# EAGLE design LED - Chaser Forward Reverse (EAGLE 9.6.2)
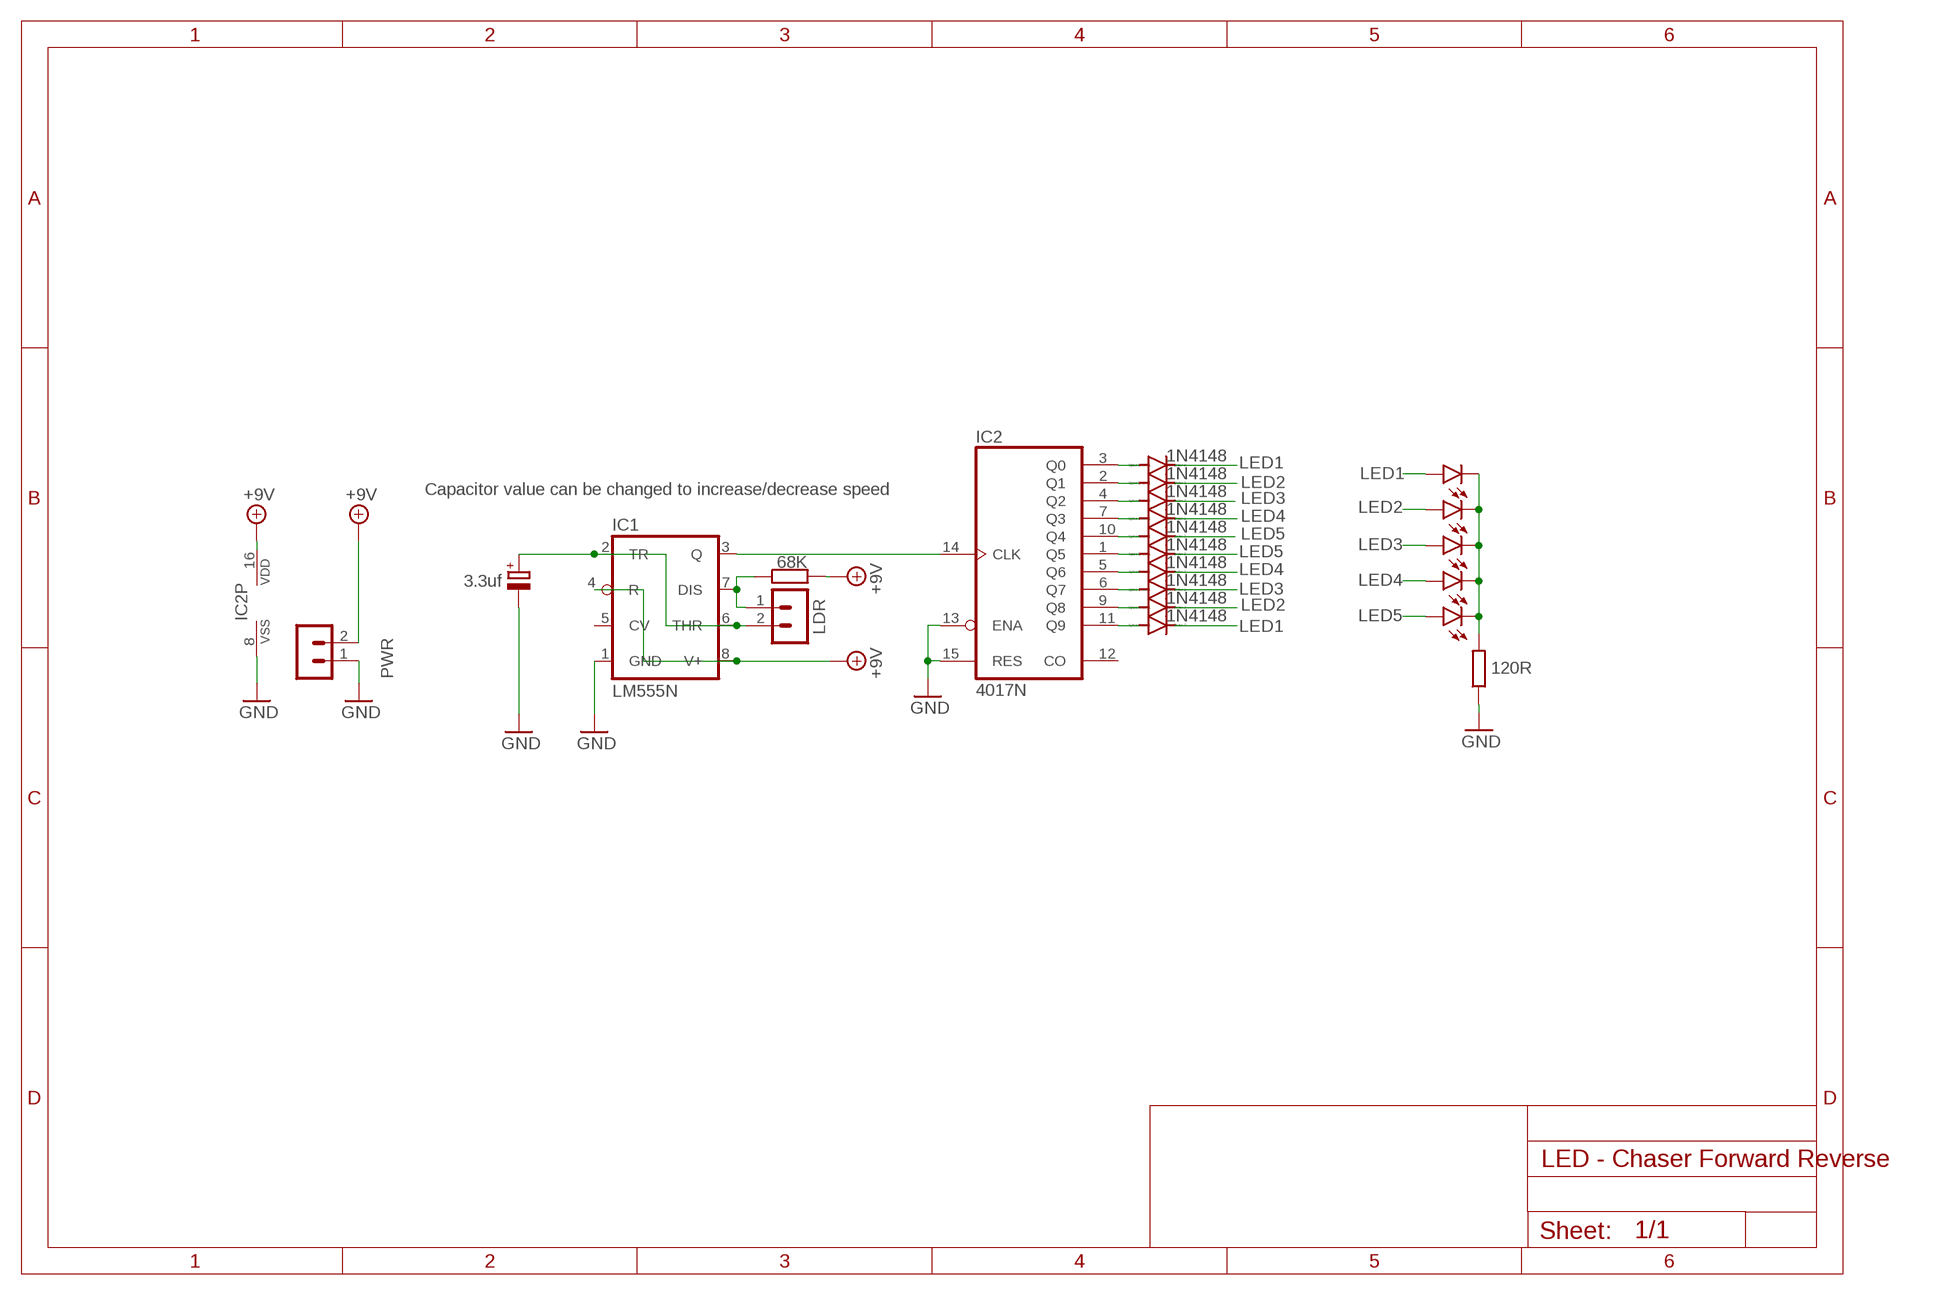
[diagram p0: schematic, sheet 1]

## Parts
C1  3.3uf  CPOL-EUE2.5-5  [E2,5-5]
D1  1N4148  1N4148DO35-7  [DO35-7]
D2  1N4148  1N4148DO35-7  [DO35-7]
D3  1N4148  1N4148DO35-7  [DO35-7]
D4  1N4148  1N4148DO35-7  [DO35-7]
D5  1N4148  1N4148DO35-7  [DO35-7]
D6  1N4148  1N4148DO35-7  [DO35-7]
D7  1N4148  1N4148DO35-7  [DO35-7]
D8  1N4148  1N4148DO35-7  [DO35-7]
D9  1N4148  1N4148DO35-7  [DO35-7]
D10  1N4148  1N4148DO35-7  [DO35-7]
IC1  LM555N  [DIL08]
IC2  4017N  [DIL16]
LDR  B2B-PH-K-S  [B2B-PH-K-S]
LED1  LED3MM  [LED3MM]
LED2  LED3MM  [LED3MM]
LED3  LED3MM  [LED3MM]
LED4  LED3MM  [LED3MM]
LED5  LED3MM  [LED3MM]
PWR  B2B-PH-K-S  [B2B-PH-K-S]
R1  68K  R-EU_0207/10  [0207/10]
R2  120R  R-EU_0207/10  [0207/10]

## Nets
+9V: IC1.4(R) IC1.8(V+) IC2.16(VDD) PWR.2 R1.2
GND: C1.- IC1.1(GND) IC2.8(VSS) IC2.13(ENA) IC2.15(RES) PWR.1 R2.1
LED1: D1.C D10.C LED1.A
LED2: D2.C D9.C LED2.A
LED3: D3.C D8.C LED3.A
LED4: D4.C D7.C LED4.A
LED5: D5.C D6.C LED5.A
N$1: IC1.7(DIS) LDR.1 R1.1
N$2: C1.+ IC1.2(TR) IC1.6(THR) LDR.2
N$3: IC1.3(Q) IC2.14(CLK)
N$4: LED1.K(C) LED2.K(C) LED3.K(C) LED4.K(C) LED5.K(C) R2.2
N$5: D1.A IC2.3(Q0)
N$6: D2.A IC2.2(Q1)
N$7: D3.A IC2.4(Q2)
N$8: D4.A IC2.7(Q3)
N$9: D5.A IC2.10(Q4)
N$10: D6.A IC2.1(Q5)
N$11: D7.A IC2.5(Q6)
N$12: D8.A IC2.6(Q7)
N$13: D9.A IC2.9(Q8)
N$14: D10.A IC2.11(Q9)
Unconnected: IC1.5(CV) IC2.12(CO)

## Notes on the sheet
- Capacitor value can be changed to increase/decrease speed

## Library data of the parts
C1 = rcl:CPOL-EU: POLARIZED CAPACITOR, European symbol; SPICEPREFIX: C
D1-D10 = diode:1N4148: DIODE high speed (Philips)
IC1 = linear4:*555: TIMER
IC2 = 40xx:4017: COUNTER/DIVIDER
LDR PWR = con-JST PH:B2B-PH: JST PH series header 2.00mm pitch disconnectable crimp style connectors, vertical (side entry type), 2 pins
LED1-LED5 = led:LED: LED OSRAM: - CHIPLED LG R971, LG N971, LY N971, LG Q971, LY Q971, LO R971, LY R971 LH N974, LH R974 LS Q976, LO Q976, LY Q976 LO Q996 - Hyper CHIPLED LW Q18S LB Q993, LB Q99A, LB R99A - SideLED LS A670, LO A670, LY A670, LG A670, LP A670 LB A673, LV A673, LT A673, LW A673 LH A674 LY A675 LS A676, LA A676, LO A676, LY A676, LW A676 LS A679, LY A679, LG A679 - Hyper Micro SIDELED® LS Y876, LA Y876, LO Y876, LY Y876 LT Y87S - SmartLED LW L88C, LW L88S LB L89C, LB L89S, LG L890 LS L89K, LO L89K, LY L89K LS L896, LA L896, LO L896, LY L896 - TOPLED LS T670, LO T670, LY T670, LG T670, LP T670 LSG T670, LSP T670, LSY T670, LOP T670, LYG T670 LG T671, LOG T671, LSG T671 LB T673, LV T673, LT T673, LW T673 LH T674 LS T676, LA T676, LO T676, LY T676, LB T676, LH T676, LSB T676, LW T676 LB T67C, LV T67C, LT T67C, LS T67K, LO T67K, LY T67K, LW E67C LS E67B, LA E67B, LO E67B, LY E67B, LB E67C, LV E67C, LT E67C LW T67C LS T679, LY T679, LG T679 LS T770, LO T770, LY T770, LG T770, LP T770 LB T773, LV T773, LT T773, LW T773 LH T774 LS E675, LA E675, LY E675, LS T675 LS T776, LA T776, LO T776, LY T776, LB T776 LHGB T686 LT T68C, LB T68C - Hyper Mini TOPLED® LB M676 - Mini TOPLED Santana® LG M470 LS M47K, LO M47K, LY M47K Source: http://www.osram.convergy.de LUXEON: - LUMILED® LXK2-PW12-R00, LXK2-PW12-S00, LXK2-PW14-U00, LXK2-PW14-V00 LXK2-PM12-R00, LXK2-PM12-S00, LXK2-PM14-U00 LXK2-PE12-Q00, LXK2-PE12-R00, LXK2-PE12-S00, LXK2-PE14-T00, LXK2-PE14-U00 LXK2-PB12-K00, LXK2-PB12-L00, LXK2-PB12-M00, LXK2-PB14-N00, LXK2-PB14-P00, LXK2-PB14-Q00 LXK2-PR12-L00, LXK2-PR12-M00, LXK2-PR14-Q00, LXK2-PR14-R00 LXK2-PD12-Q00, LXK2-PD12-R00, LXK2-PD12-S00 LXK2-PH12-R00, LXK2-PH12-S00 LXK2-PL12-P00, LXK2-PL12-Q00, LXK2-PL12-R00 Source: www.luxeon.com KINGBRIGHT: KA-3528ASYC Source: www.kingbright.com
R1 R2 = rcl:R-EU_: RESISTOR, European symbol; SPICEPREFIX: R

## Board
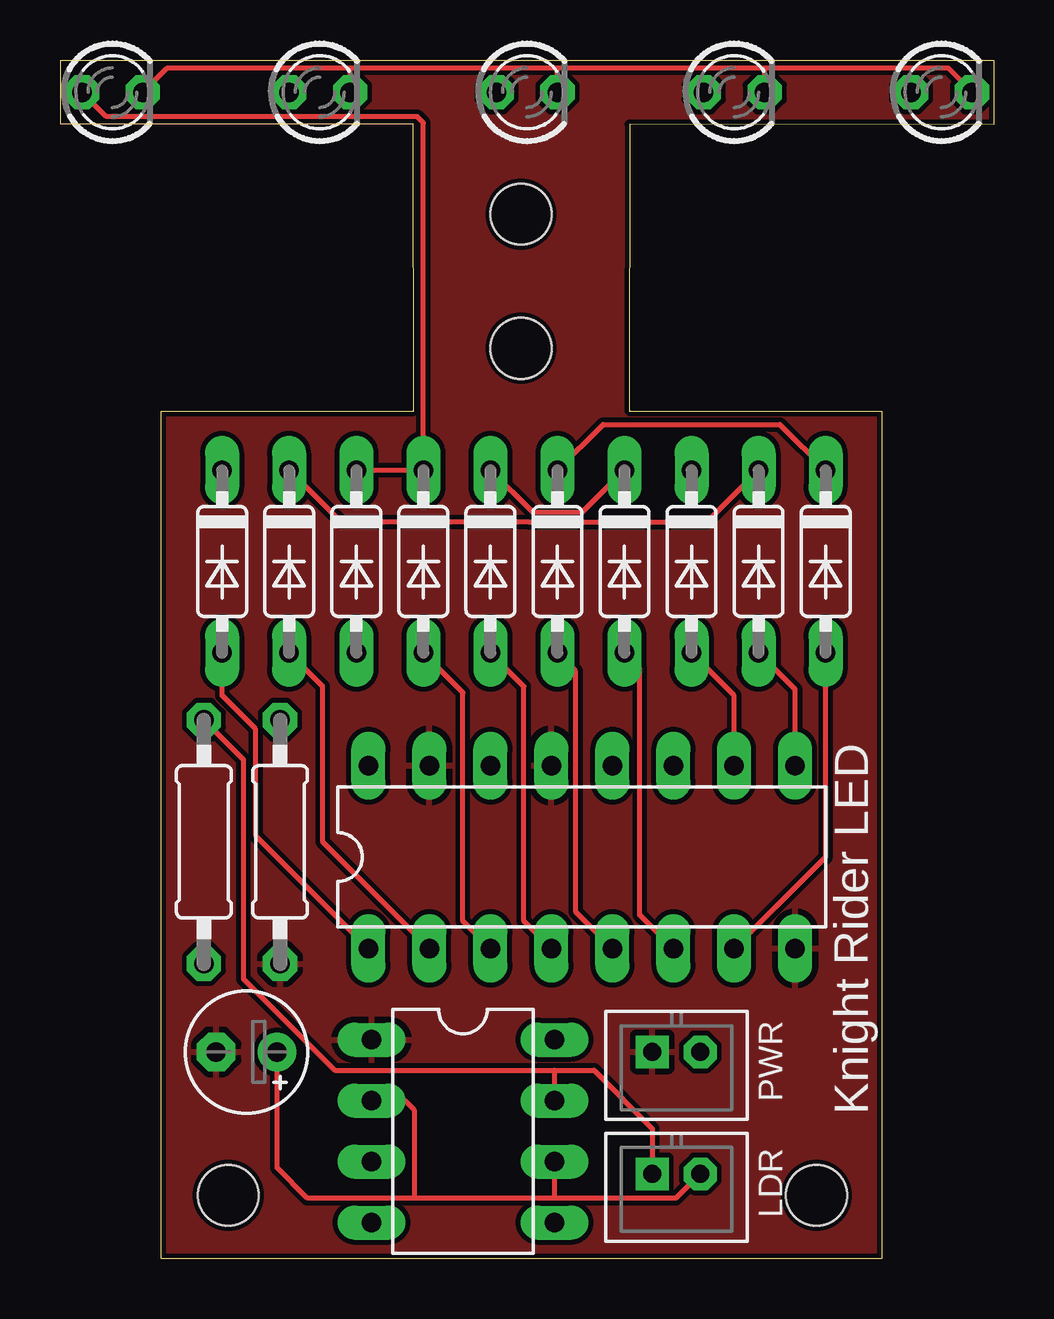
[diagram p1: board, top side]
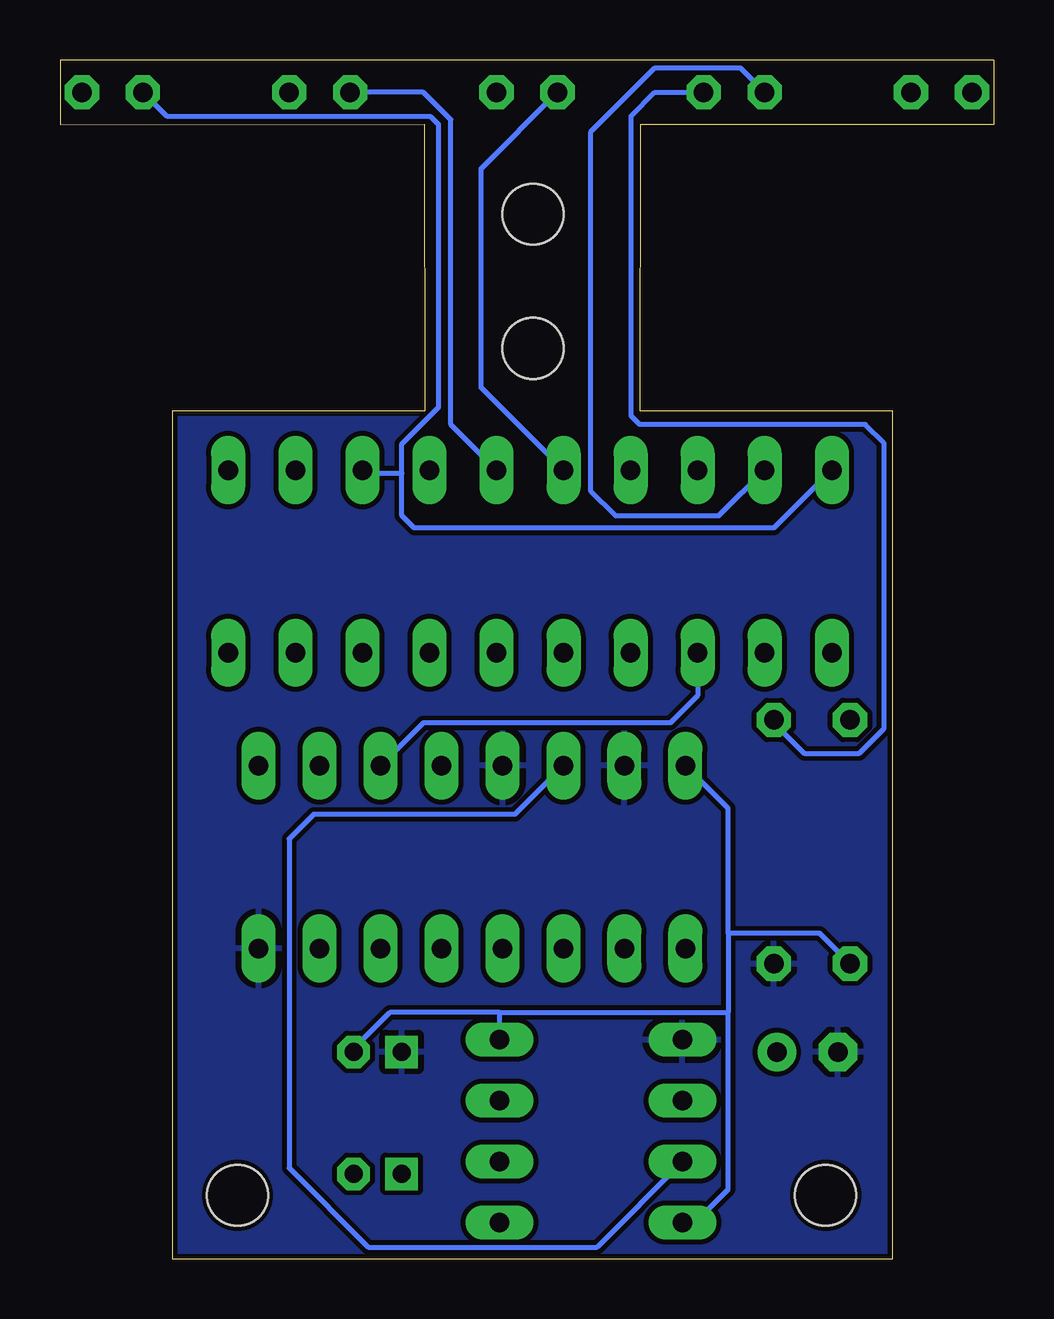
[diagram p2: board, bottom side, seen from below]

Size 38.91 x 49.96 mm. Coordinates in mm from the lower left corner, seen from the top.
Outline: 0,49.96 0,47.29 14.72,47.28 14.73,35.33 4.22,35.33 4.22,0 34.24,0 34.24,35.33 23.72,35.33 23.74,47.28 38.91,47.27 38.91,49.96 0,49.96
Copper layers (1*16): Top 0.035mm / dielectric 1.5mm / Bottom 0.035mm
Design rules "SparkFun": minimum track width 8mil, minimum drill 20mil, track to track 8mil, track to pad 8mil, pad to pad 8mil, via to via 8mil, smd to smd 8mil, copper to edge 8mil, drill to drill 8mil, minimum pad ring 12mil, minimum via ring 10mil, stop-mask expansion 4mil, vias tented up to drill 20mil, thermal gap 10mil
Holes 2.54 mm at 19.2,37.95 31.52,2.64 7.01,2.64 19.2,43.54

### Footprints (pad centres in the part's own frame; a part is rotated, then mirrored left to right if it is on the bottom)
E2,5-5 = drill 0.813 pad 1.6: + -1.27,0 | drill 0.813 pad 1.6 octagon: - 1.27,0
DO35-7 = drill 0.813 long: A 3.81,0; C -3.81,0
DIL08 = drill 0.813 long: 1 -3.81,-3.81; 2 -1.27,-3.81; 3 1.27,-3.81; 4 3.81,-3.81; 5 3.81,3.81; 6 1.27,3.81; 7 -1.27,3.81; 8 -3.81,3.81
DIL16 = drill 0.813 long: 1 -8.89,-3.81; 2 -6.35,-3.81; 3 -3.81,-3.81; 4 -1.27,-3.81; 5 1.27,-3.81; 6 3.81,-3.81; 7 6.35,-3.81; 8 8.89,-3.81; 9 8.89,3.81; 10 6.35,3.81; 11 3.81,3.81; 12 1.27,3.81; 13 -1.27,3.81; 14 -3.81,3.81; 15 -6.35,3.81; 16 -8.89,3.81
B2B-PH-K-S = drill 0.75 pad 1.3 square: 1 1,0 | drill 0.75 pad 1.3 octagon: 2 -1,0
LED3MM = drill 0.813 octagon: A -1.27,0; K 1.27,0
0207/10 = drill 0.813 octagon: 1 -5.08,0; 2 5.08,0

### Placement (x,y rotation side)
C1  7.77,8.61 180 top
D1  15.14,29.06 270 top
D2  9.55,29.06 270 top
D3  17.93,29.06 270 top
D4  31.9,29.06 270 top
D5  26.31,29.06 270 top
D6  6.76,29.06 270 top
D7  20.73,29.06 270 top
D8  23.52,29.06 270 top
D9  29.11,29.06 270 top
D10  12.34,29.06 270 top
IC1  16.79,5.31 270 top
IC2  21.74,16.74 0 top
LDR  25.68,3.53 180 top
LED1  2.18,48.62 0 top
LED2  10.82,48.62 0 top
LED3  19.46,48.62 0 top
LED4  28.09,48.62 0 top
LED5  36.73,48.62 0 top
PWR  25.68,8.61 180 top
R1  5.99,17.37 270 top
R2  9.17,17.37 90 top

### Tracks (layer width: path | path; a pad name or v marks a point on that pad's centre or on a via)
+9V
  Bottom 0.203: IC2.16 11.07,18.77 11.07,13.56 | IC1.4 12.47,1.5 11.07,2.9 11.07,10.26 | 11.07,13.56 11.07,10.26 | IC1.8 20.6,10.26 | 20.6,10.26 25.17,10.26 26.68,8.75 PWR.2 | 20.6,10.26 11.07,10.26 | R1.2 7.26,13.56 11.07,13.56
GND
  pour Top: 0,49.96 38.91,49.96 38.91,47.27 23.72,47.27 23.72,35.33 34.24,35.33 34.24,0 4.22,0 4.22,35.33 14.73,35.33 14.73,47.29 0,47.29
  pour Bottom: 0,49.96 38.91,49.96 38.91,47.27 23.72,47.27 23.72,35.33 34.24,35.33 34.24,0 4.22,0 4.22,35.33 14.73,35.33 14.73,47.29 0,47.29
LED1
  Top 0.203: D10.C D1.C 15.14,47.35 14.88,47.6 1.93,47.6 LED1.A
LED2
  Top 0.203: D9.C 26.92,30.68 19.54,30.68 19.52,30.71 11.71,30.71 D2.C
  Bottom 0.203: LED2.A 10.57,49.63 14.12,49.63 16.79,46.96 16.79,31.98 15.77,30.96 11.46,30.96 D2.C
LED3
  Top 0.203: D8.C 21.74,31.09 19.71,31.09 D3.C
  Bottom 0.203: D3.C 21.36,36.3 21.36,45.44 LED3.A
LED4
  Top 0.203: D7.C 22.63,34.77 30,34.77 D4.C
  Bottom 0.203: D7.C 22.63,34.77 22.63,47.47 23.77,48.62 LED4.A
LED5
  Bottom 0.203: D6.C 9.17,30.45 24.16,30.45 24.66,30.96 24.66,32.74 | LED5.A 34.44,47.6 23.47,47.6 23.14,47.27 23.14,35.48 24.66,33.96 24.66,32.74 | D5.C 26.19,32.74 24.66,32.74
N$1
  Top 0.203: R1.1 7.65,20.8 7.65,11.66 11.46,7.85 20.6,7.85 | 20.6,7.85 IC1.7 | 20.6,7.85 22.25,7.85 24.68,5.42 LDR.1
N$2
  Top 0.203: LDR.2 25.66,2.51 20.6,2.51 | 20.6,2.51 14.76,2.51 | 14.76,2.51 10.31,2.51 9.04,3.78 C1.+ | IC1.6 20.6,2.51 | IC1.2 14.38,6.58 14.76,6.2 14.76,2.51
N$3
  Bottom 0.203: IC2.14 19.96,18.52 28.35,18.52 29.36,17.5 29.36,3.78 26.06,0.48 16.54,0.48 IC1.3
N$4
  Top 0.203: LED1.K 4.47,49.63 12.09,49.63 | 12.09,49.63 20.73,49.63 | 20.73,49.63 29.36,49.63 | 29.36,49.63 37.01,49.63 38,48.64 LED5.K | LED4.K 29.36,49.63 | LED3.K 20.73,49.63 | LED2.K 12.09,49.63
  Bottom 0.203: R2.2 9.17,22.33 7.9,21.06 5.61,21.06 4.6,22.07 4.6,34.01 5.36,34.77 14.76,34.77 15.11,35.13 15.11,47.62 14.12,48.62 LED2.K
N$5
  Top 0.203: IC2.3 16.79,14.07 16.79,23.6 D1.A
N$6
  Top 0.203: IC2.2 10.95,17.37 10.95,23.85 D2.A
N$7
  Top 0.203: IC2.4 19.33,14.07 19.33,23.85 D3.A
N$8
  Top 0.203: IC2.7 31.9,16.74 D4.A
N$9
  Top 0.203: IC2.10 28.09,23.47 D5.A
N$10
  Top 0.203: IC2.1 8.15,17.63 8.15,22.07 6.76,23.47 D6.A
N$11
  Top 0.203: IC2.5 21.49,14.45 21.49,24.49 D7.A
N$12
  Top 0.203: IC2.6 24.16,14.33 24.16,24.61 D8.A
N$13
  Top 0.203: IC2.9 30.63,23.72 D9.A
N$14
  Bottom 0.203: D10.A 12.34,23.47 13.49,22.33 23.77,22.33 IC2.11

### Text on the board
tPlace: Knight Rider LED